# EAGLE design DC28_Jack-Attack_Badge-1 (EAGLE 9.5.0)
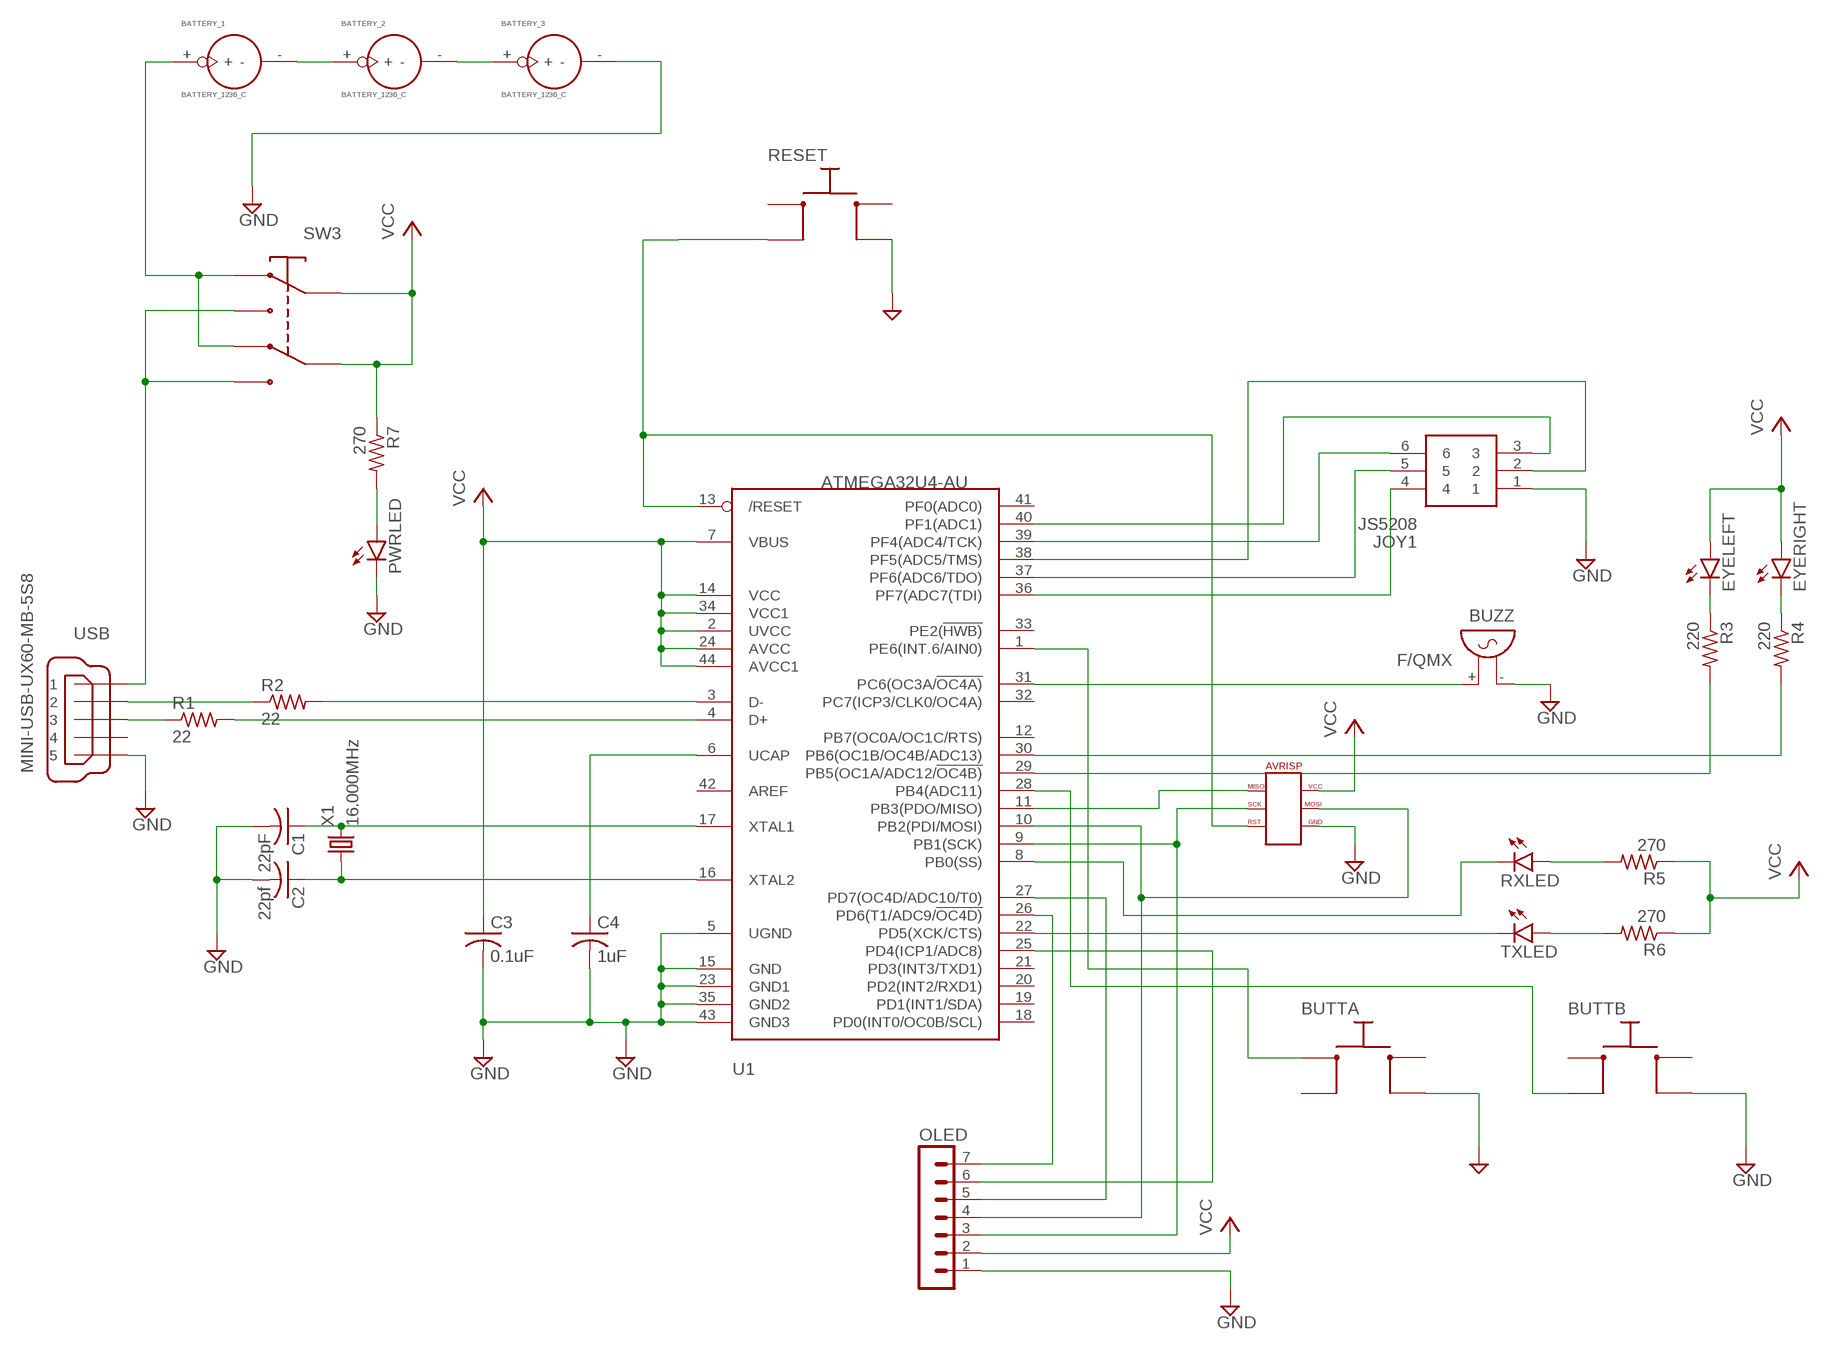
[diagram p0: schematic, sheet 1]

## Parts
BATTERY_1  BATTERY_1236_C  [BATTERY_1236_C]
BATTERY_2  BATTERY_1236_C  [BATTERY_1236_C]
BATTERY_3  BATTERY_1236_C  [BATTERY_1236_C]
BUTTA  PTS645  [PTS645_SMD]
BUTTB  PTS645  [PTS645_SMD]
BUZZ  F/QMX  [F/QMX]
C1  22pF  C-USC0805  [C0805]
C2  22pf  C-USC0805  [C0805]
C3  0.1uF  C-USC0805  [C0805]
C4  1uF  C-USC0805  [C0805]
EYELEFT  LED5MM  [LED5MM]
EYERIGHT  LED5MM  [LED5MM]
JOY1  JS5208  [JS5208]
OLED  MA07-1  [MA07-1]
PWRLED  LEDCHIP-LED0805  [CHIP-LED0805]
R1  22  R-US_R0805  [R0805]
R2  22  R-US_R0805  [R0805]
R3  220  R-US_R0805  [R0805]
R4  220  R-US_R0805  [R0805]
R5  270  R-US_R0805  [R0805]
R6  270  R-US_R0805  [R0805]
R7  270  R-US_R0805  [R0805]
RESET  PTS645  [PTS645_SMD]
RXLED  LEDCHIP-LED0805  [CHIP-LED0805]
SW3  JS202011AQN  [JS202011AQN]
TXLED  LEDCHIP-LED0805  [CHIP-LED0805]
U1  ATMEGA32U4-AU  [TQFP44]
U$1  AVRISP_POGO  [AVRISP_POGO]
USB  MINI-USB-UX60-MB-5S8  [UX60-MB-5S8]
X1  16.000MHz  CSM-7X-DU  [CSM-7X-DU]

## Nets
BATT1: BATTERY_1.+ SW3.P$1 SW3.P$4
GND: BATTERY_3.- BUTTA.P$4 BUTTB.P$4 BUZZ.- C1.2 C2.2 C3.2 C4.2 JOY1.1 OLED.1 PWRLED.C RESET.P$4 U1.5(UGND) U1.15(GND) U1.23(GND1) U1.35(GND2) U1.43(GND3) U$1.P$6 U$1.P$6B USB.5
N$1: R1.1 USB.3
N$2: R2.2 U1.3(D-)
N$3: R2.1 USB.2
N$4: R1.2 U1.4(D+)
N$5: C4.1 U1.6(UCAP)
N$6: BUTTA.P$1 U1.1(PE6(INT.6/AIN0))
N$7: C2.1 U1.16(XTAL2) X1.1
N$8: C1.1 U1.17(XTAL1) X1.2
N$9: JOY1.4 U1.36(PF7(ADC7(TDI))
N$10: U1.11(PB3(PDO/MISO)) U$1.P$1 U$1.P$1B
N$11: OLED.3 U1.9(PB1(SCK)) U$1.P$3 U$1.P$3B
N$12: OLED.4 U1.10(PB2(PDI/MOSI)) U$1.P$4 U$1.P$4B
N$13: JOY1.5 U1.37(PF6(ADC6/TDO))
N$14: BUTTB.P$2 U1.28(PB4(ADC11))
N$15: RESET.P$2 U1.13(/RESET) U$1.P$5 U$1.P$5B
N$16: BUZZ.+ U1.31(PC6(OC3A/!OC4A))
N$17: TXLED.C U1.22(PD5(XCK/CTS))
N$18: JOY1.6 U1.39(PF4(ADC4/TCK))
N$19: JOY1.2 U1.38(PF5(ADC5/TMS))
N$20: R6.2 TXLED.A
N$21: RXLED.C U1.8(PB0(SS))
N$22: R5.2 RXLED.A
N$23: JOY1.3 U1.40(PF1(ADC1))
N$24: PWRLED.A R7.2
N$25: OLED.5 U1.27(PD7(OC4D/ADC10/T0))
N$26: OLED.6 U1.25(PD4(ICP1/ADC8))
N$27: BATTERY_1.- BATTERY_2.+
N$28: BATTERY_2.- BATTERY_3.+
N$29: OLED.7 U1.26(PD6(T1/ADC9/!OC4D))
N$30: R4.2 U1.30(PB6(OC1B/OC4B/ADC13))
N$31: R3.2 U1.29(PB5(OC1A/ADC12/!OC4B))
N$34: EYERIGHT.K(C) R4.1
N$35: EYELEFT.K(C) R3.1
USB+5V: SW3.P$3 SW3.P$6 USB.1
VCC: C3.1 EYELEFT.A EYERIGHT.A OLED.2 R5.1 R6.1 R7.1 SW3.P$2 SW3.P$5 U1.2(UVCC) U1.7(VBUS) U1.14(VCC) U1.24(AVCC) U1.34(VCC1) U1.44(AVCC1) U$1.P$2 U$1.P$2B
Unconnected: BUTTA.P$2 BUTTA.P$3 BUTTB.P$1 BUTTB.P$3 RESET.P$1 RESET.P$3 U1.12(PB7(OC0A/OC1C/RTS)) U1.18(PD0(INT0/OC0B/SCL)) U1.19(PD1(INT1/SDA)) U1.20(PD2(INT2/RXD1)) U1.21(PD3(INT3/TXD1)) U1.32(PC7(ICP3/CLK0/OC4A)) U1.33(PE2(!HWB)) U1.41(PF0(ADC0)) U1.42(AREF) USB.4

## Library data of the parts
BATTERY_1-BATTERY_3 = Itead_BP_110825:BATTERY_1236_C: SOC004
BUTTA BUTTB RESET = macetech:PTS645
BUZZ = buzzer:F/QMX: BUZZER Source: Buerklin; OC_FARNELL: unknown; OC_NEWARK: unknown
C1-C4 = rcl:C-US: CAPACITOR, American symbol
EYELEFT EYERIGHT PWRLED RXLED TXLED = led:LED: LED OSRAM: - CHIPLED LG R971, LG N971, LY N971, LG Q971, LY Q971, LO R971, LY R971 LH N974, LH R974 LS Q976, LO Q976, LY Q976 LO Q996 - Hyper CHIPLED LW Q18S LB Q993, LB Q99A, LB R99A - SideLED LS A670, LO A670, LY A670, LG A670, LP A670 LB A673, LV A673, LT A673, LW A673 LH A674 LY A675 LS A676, LA A676, LO A676, LY A676, LW A676 LS A679, LY A679, LG A679 - Hyper Micro SIDELED® LS Y876, LA Y876, LO Y876, LY Y876 LT Y87S - SmartLED LW L88C, LW L88S LB L89C, LB L89S, LG L890 LS L89K, LO L89K, LY L89K LS L896, LA L896, LO L896, LY L896 - TOPLED LS T670, LO T670, LY T670, LG T670, LP T670 LSG T670, LSP T670, LSY T670, LOP T670, LYG T670 LG T671, LOG T671, LSG T671 LB T673, LV T673, LT T673, LW T673 LH T674 LS T676, LA T676, LO T676, LY T676, LB T676, LH T676, LSB T676, LW T676 LB T67C, LV T67C, LT T67C, LS T67K, LO T67K, LY T67K, LW E67C LS E67B, LA E67B, LO E67B, LY E67B, LB E67C, LV E67C, LT E67C LW T67C LS T679, LY T679, LG T679 LS T770, LO T770, LY T770, LG T770, LP T770 LB T773, LV T773, LT T773, LW T773 LH T774 LS E675, LA E675, LY E675, LS T675 LS T776, LA T776, LO T776, LY T776, LB T776 LHGB T686 LT T68C, LB T68C - Hyper Mini TOPLED® LB M676 - Mini TOPLED Santana® LG M470 LS M47K, LO M47K, LY M47K Source: http://www.osram.convergy.de LUXEON: - LUMILED® LXK2-PW12-R00, LXK2-PW12-S00, LXK2-PW14-U00, LXK2-PW14-V00 LXK2-PM12-R00, LXK2-PM12-S00, LXK2-PM14-U00 LXK2-PE12-Q00, LXK2-PE12-R00, LXK2-PE12-S00, LXK2-PE14-T00, LXK2-PE14-U00 LXK2-PB12-K00, LXK2-PB12-L00, LXK2-PB12-M00, LXK2-PB14-N00, LXK2-PB14-P00, LXK2-PB14-Q00 LXK2-PR12-L00, LXK2-PR12-M00, LXK2-PR14-Q00, LXK2-PR14-R00 LXK2-PD12-Q00, LXK2-PD12-R00, LXK2-PD12-S00 LXK2-PH12-R00, LXK2-PH12-S00 LXK2-PL12-P00, LXK2-PL12-Q00, LXK2-PL12-R00 Source: www.luxeon.com KINGBRIGHT: KA-3528ASYC Source: www.kingbright.com
JOY1 = JS5208:JS5208: E-SWITCH - JS5208 - SWITCH, NAVIGATION, 5 POSITION, 20mA, SMD Source: Datasheet <https://www.e-switch.com/system/asset/product_line/data_sheet/23/JS5208.pdf>; DESCRIPTION: E-SWITCH - JS5208 - SWITCH, NAVIGATION, 5 POSITION, 20mA, SMD; HEIGHT: mm; MANUFACTURER_NAME: E-Switch; MANUFACTURER_PART_NUMBER: JS5208; MOUSER_PART_NUMBER: 612-JS5208; MOUSER_PRICE-STOCK: https://www.mouser.com/Search/Refine.aspx?Keyword=612-JS5208
OLED = con-lstb:MA07-1: PIN HEADER; OC_FARNELL: unknown; OC_NEWARK: unknown
R1-R7 = rcl:R-US_: RESISTOR, American symbol
SW3 = macetech:JS202011AQN
U1 = adafruit:ATMEGA32U4: http://www.ladyada.net/library/eagle
U$1 = macetech:AVRISP_POGO
USB = con-hirose:MINI-USB-: MINI USB Connector Source: http://www.hirose.co.jp/cataloge_hp/e24000019.pdf; OC_FARNELL: unknown; OC_NEWARK: unknown
X1 = crystal:CSM-7X-DU: SMD CRYSTAL Source: www.ecsxtal.com .. Crystal 3.6864MHz CSM_7X_DU.PDF; OC_FARNELL: unknown; OC_NEWARK: unknown

## Board
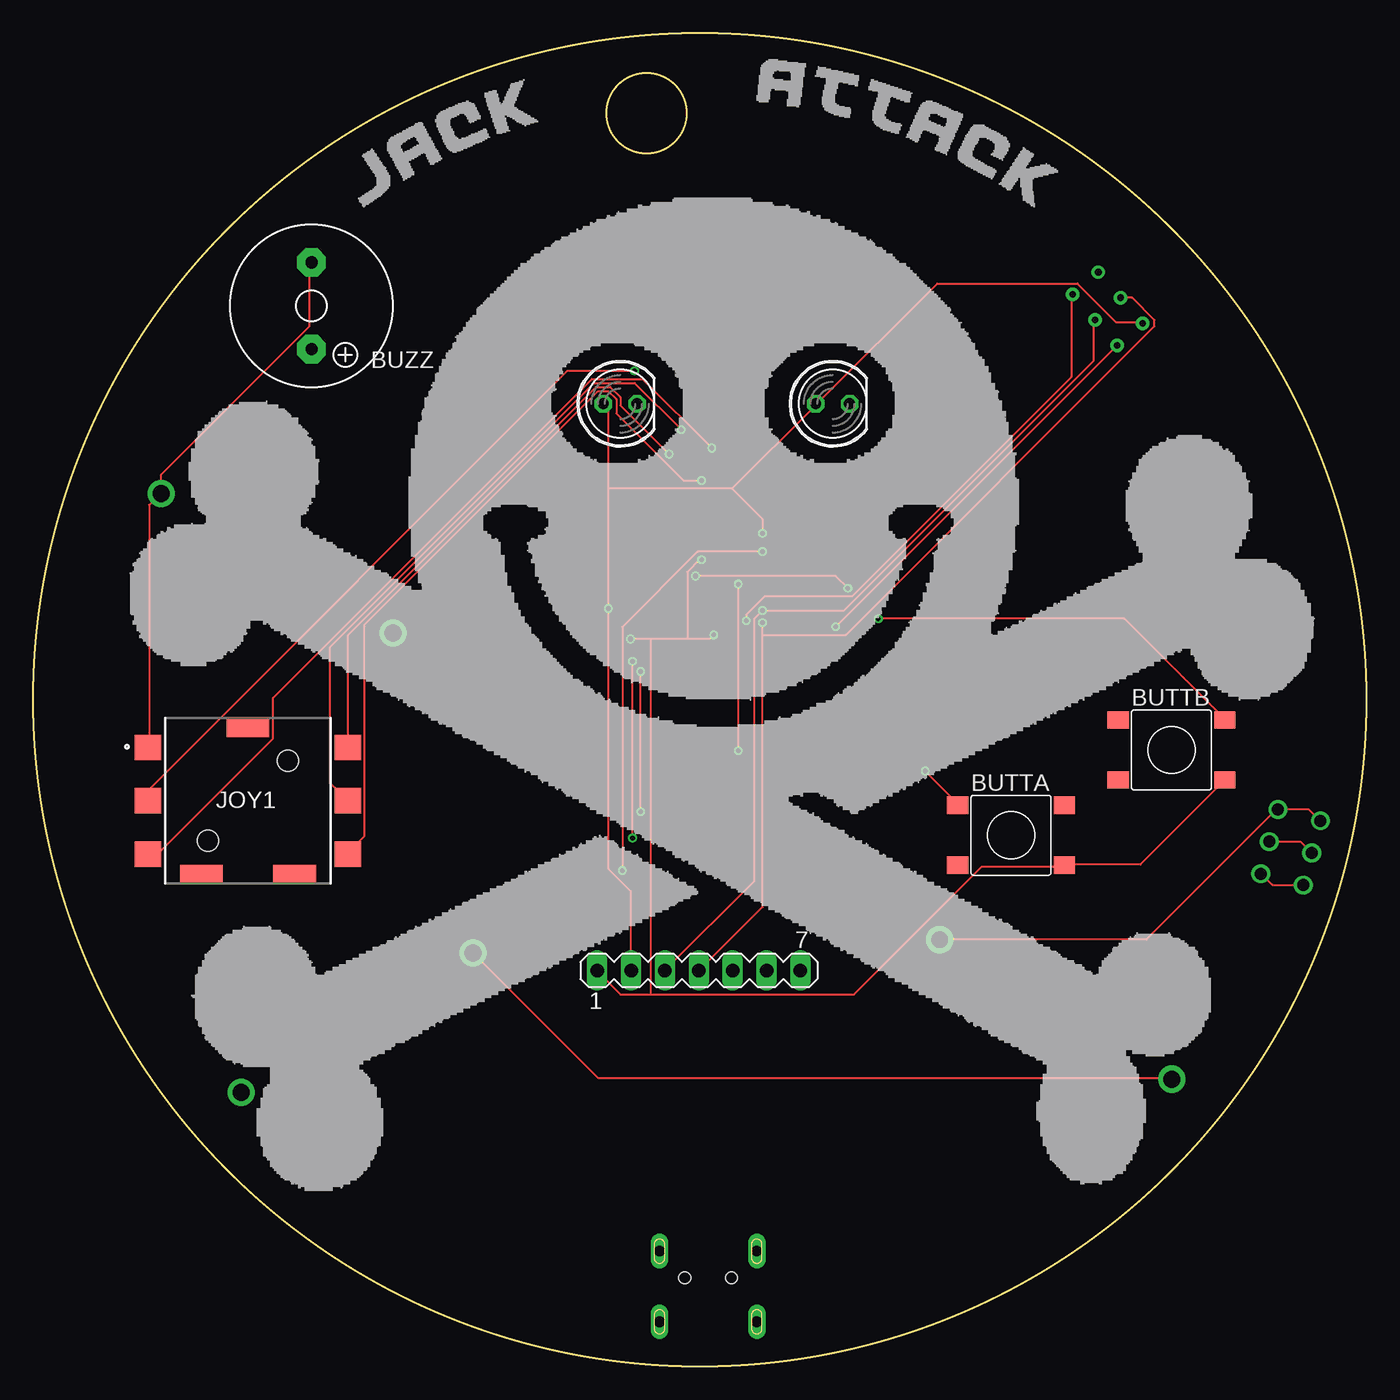
[diagram p1: board, top side]
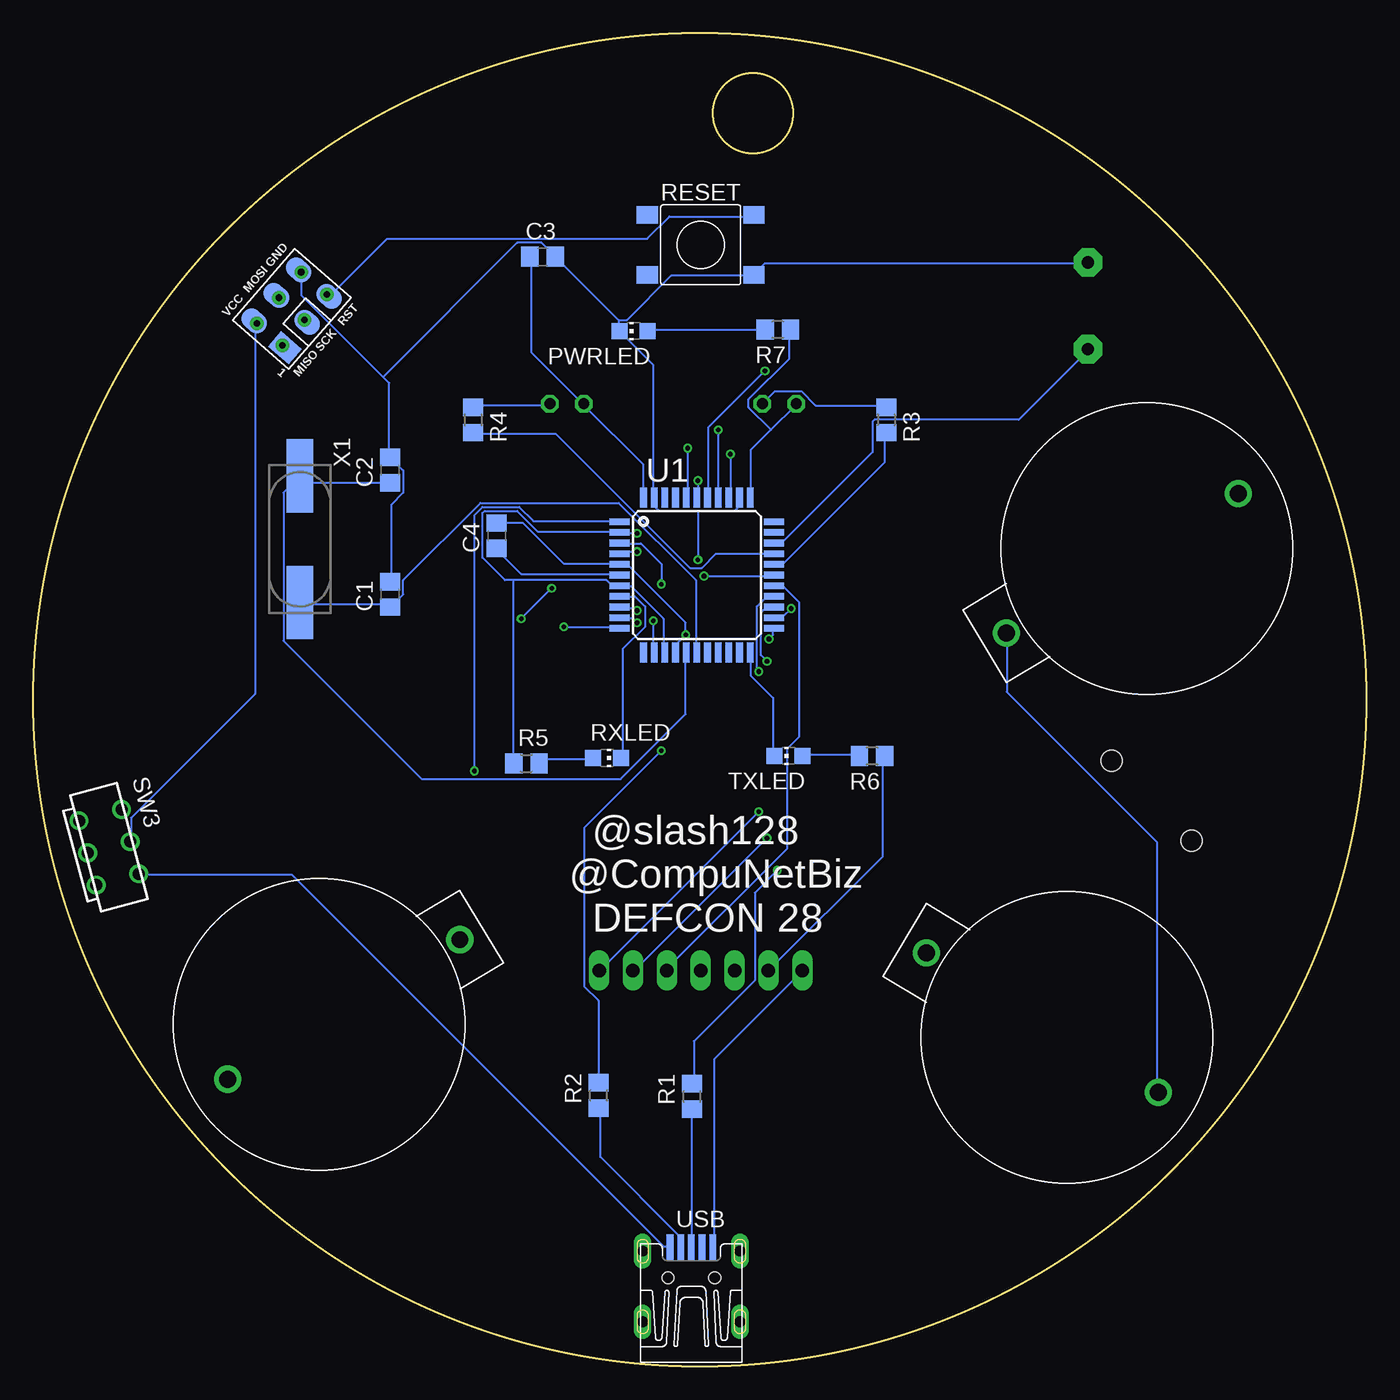
[diagram p2: board, bottom side, seen from below]

Size 100 x 100 mm. Coordinates in mm from the lower left corner, seen from the top.
Outline: circle at 50,50 radius 50
Outline: circle at 46,94 radius 3
Copper layers (1*16): Top 0.035mm / dielectric 1.5mm / Bottom 0.035mm
Design rules "SeeedStudio_2layer_DRU_no_angle_20140221": minimum track width 6mil, minimum drill 12mil, track to track 6mil, track to pad 6mil, pad to pad 6mil, via to via 6mil, smd to smd 0mil, copper to edge 10mil, drill to drill 10mil, minimum pad ring 10mil, minimum via ring 6mil, stop-mask expansion 2mil, vias tented up to drill 100mil, thermal gap 10mil

### Footprints (pad centres in the part's own frame; a part is rotated, then mirrored left to right if it is on the bottom)
BATTERY_1236_C = drill 1.27 pad 2.032: + 0,0; - 0,20.32
PTS645_SMD = smd 1.6 x 1.3: P$1 -4,2.25; P$2 4,2.25; P$3 -4,-2.25; P$4 4,-2.25
F/QMX = drill 0.914 pad 2.159 octagon: + 3.251,0; - -3.251,0
C0805 = smd 1.3 x 1.5: 1 -0.95,0; 2 0.95,0
LED5MM = drill 0.813 octagon: A -1.27,0; K 1.27,0
JS5208 = smd 2 x 1.9: 1 -7.5,4; 2 -7.5,0; 3 -7.5,-4; 4 7.5,4; 5 7.5,0; 6 7.5,-4 | smd 3.2 x 1.45: 7 -3.5,-5.525; 8 3.5,-5.525; 9 0,5.525 | hole 1.6: 3,3; -3,-3
MA07-1 = drill 1.016 long: 1 -7.62,0; 2 -5.08,0; 3 -2.54,0; 4 0,0; 5 2.54,0; 6 5.08,0; 7 7.62,0
CHIP-LED0805 = smd 1.2 x 1.2: A 0,-1.05; C 0,1.05
R0805 = smd 1.3 x 1.5: 1 -0.95,0; 2 0.95,0
JS202011AQN = drill 0.9: P$1 -2.5,1.65; P$2 0,1.65; P$3 2.5,1.65; P$4 -2.5,-1.65; P$5 0,-1.65; P$6 2.5,-1.65
TQFP44 = smd 1.5 x 0.5: 1 -5.8,4; 2 -5.8,3.2; 3 -5.8,2.4; 4 -5.8,1.6; 5 -5.8,0.8; 6 -5.8,0; 7 -5.8,-0.8; 8 -5.8,-1.6; 9 -5.8,-2.4; 10 -5.8,-3.2; 11 -5.8,-4; 23 5.8,-4; 24 5.8,-3.2; 25 5.8,-2.4; 26 5.8,-1.6; 27 5.8,-0.8; 28 5.8,0; 29 5.8,0.8; 30 5.8,1.6; 31 5.8,2.4; 32 5.8,3.2; 33 5.8,4 | smd 0.5 x 1.5: 12 -4,-5.8; 13 -3.2,-5.8; 14 -2.4,-5.8; 15 -1.6,-5.8; 16 -0.8,-5.8; 17 0,-5.8; 18 0.8,-5.8; 19 1.6,-5.8; 20 2.4,-5.8; 21 3.2,-5.8; 22 4,-5.8; 34 4,5.8; 35 3.2,5.8; 36 2.4,5.8; 37 1.6,5.8; 38 0.8,5.8; 39 0,5.8; 40 -0.8,5.8; 41 -1.6,5.8; 42 -2.4,5.8; 43 -3.2,5.8; 44 -4,5.8
AVRISP_POGO = smd 2.032 x 1.524: P$1 -1.524,2.54; P$2 1.524,2.54; P$3 -1.524,0; P$4 1.524,0; P$5 -1.524,-2.54; P$6 1.524,-2.54 | drill 0.5: P$1B -1.27,2.54; P$2B 1.27,2.54; P$3B -1.27,0; P$4B 1.27,0; P$5B -1.27,-2.54; P$6B 1.27,-2.54
UX60-MB-5S8 = smd 2 x 0.5: 1 8.65,1.6; 2 8.65,0.8; 3 8.65,0; 4 8.65,-0.8; 5 8.65,-1.6 | drill 0.8 long: M1 3.1,-3.65; M2 3.1,3.65; M3 8.4,3.65; M4 8.4,-3.65 | hole 0.9: 6.4,-1.75; 6.4,1.75
CSM-7X-DU = smd 5.5 x 2: 1 -4.75,0; 2 4.75,0

### Placement (x,y rotation side)
BATTERY_1  68,32 121 bottom
BATTERY_2  33,31 239 bottom
BATTERY_3  27,55 301 bottom
BUTTA  73.35,39.83 0 top
BUTTB  85.39,46.23 0 top
BUZZ  20.87,79.56 270 top
C1  73.23,57.91 90 bottom
C2  73.23,67.23 90 bottom
C3  61.79,83.23 0 bottom
C4  65.23,62.31 90 bottom
EYELEFT  44.03,72.21 0 top
EYERIGHT  59.97,72.21 0 top
JOY1  16.11,42.42 0 top
OLED  49.93,29.69 0 top
PWRLED  54.96,77.67 90 bottom
R1  50.58,20.24 90 bottom
R2  57.58,20.32 90 bottom
R3  36,71 270 bottom
R4  67,71 270 bottom
R5  63.01,45.23 0 bottom
R6  37.07,45.77 180 bottom
R7  44.15,77.77 180 bottom
RESET  49.93,84.13 0 bottom
RXLED  56.95,45.63 270 bottom
SW3  94.33,38.93 285 bottom
TXLED  43.35,45.8 90 bottom
U1  50.22,59.36 0 bottom
U$1  80.61,79.33 139 bottom
USB  50.63,0.23 90 bottom
X1  80,62.04 270 bottom

### Tracks (layer width: path | path; a pad name or v marks a point on that pad's centre or on a via)
BATT1
  Top 0.152: SW3.P$4 96.47,41 95.71,41.76 93.42,41.76 SW3.P$1 93.27,41.76 83.52,32 68.12,32 BATTERY_1.+
GND  (via drill 0.35)
  Top 0.152: 49.07,54.56 50.75,54.56 v51.05,54.86 | 49.07,54.56 46.33,54.56 | 46.33,54.56 v44.81,54.56 | BUTTB.P$4 89.31,43.89 83.06,37.64 77.42,37.64 BUTTA.P$4 77.27,37.49 71.17,37.49 61.57,27.89 46.33,27.89 | 46.33,27.89 44.04,27.89 42.37,29.57 OLED.1 | 46.33,27.89 46.33,54.56 | JOY1.1 8.69,46.48 8.69,64.62 9.45,65.38 BATTERY_3.- 9.6,65.53 9.6,66.9 20.73,78.03 20.73,82.75 BUZZ.- | 49.07,54.56 49.07,59.59 49.99,60.5 v50.14,60.5
  Bottom 0.152: v44.81,54.56 44.5,54.86 44.5,55.32 U1.23 | U1.15 51.82,53.65 51.82,54.1 v51.05,54.86 51.05,55.78 55.32,60.05 55.93,60.05 U1.5 56.08,60.2 60.2,60.2 63.25,63.25 65.23,63.25 C4.2 | USB.5 48.92,8.99 48.92,23.01 42.37,29.57 OLED.1 | U$1.P$6 80.01,82.14 U$1.P$6B 79.86,81.99 79.86,80.31 73.76,74.22 | C1.2 73.15,58.98 73.15,64.62 72.24,65.53 72.24,67.21 73.15,68.12 C2.2 73.3,68.28 73.3,73.76 73.76,74.22 | 50.14,64.16 53.03,64.16 53.34,64.47 53.34,65.08 U1.43 53.49,65.23 53.49,75.13 55.93,77.57 PWRLED.C 56.08,77.72 56.08,78.49 | 50.14,64.16 47.4,64.16 47.09,64.47 47.09,65.08 U1.35 | 56.08,78.49 60.81,83.21 C3.2 60.96,83.36 61.87,84.28 63.7,84.28 73.76,74.22 | 56.08,78.49 55.47,78.49 52.12,81.84 46.02,81.84 RESET.P$4 45.87,81.99 45.11,82.75 20.88,82.75 BUZZ.- | 50.14,64.16 v50.14,60.5
N$1
  Bottom 0.152: R1.1 50.6,19.2 50.6,8.99 USB.3
N$2  (via drill 0.35)
  Top 0.152: v52.88,58.67 v52.88,46.18
  Bottom 0.152: v52.88,46.18 58.67,40.39 58.67,28.5 57.61,27.43 57.61,21.34 R2.2 | v52.88,58.67 52.88,60.2 54.41,61.72 55.93,61.72 U1.3
N$3
  Bottom 0.152: R2.1 57.45,19.36 57.45,15.7 51.51,9.75 51.51,8.99 USB.2
N$4  (via drill 0.35)
  Top 0.152: v44.2,37.19 44.2,55.47 49.84,61.11 v54.71,61.11
  Bottom 0.152: v44.2,37.19 45.87,35.51 45.87,28.96 50.44,24.38 50.44,21.34 R1.2 | v54.71,61.11 55.78,61.11 55.93,60.96 U1.4
N$5
  Bottom 0.152: U1.6 56.08,59.44 63.4,59.44 65.23,61.27 C4.1
N$6  (via drill 0.35)
  Top 0.152: v66.9,44.65 69.34,42.22 BUTTA.P$1
  Bottom 0.152: v66.9,44.65 66.9,63.86 66.29,64.47 63.55,64.47 62.48,63.4 56.08,63.4 U1.1
N$7
  Bottom 0.152: U1.16 51.05,53.49 51.05,48.92 55.93,44.04 70.87,44.04 81.23,54.41 81.23,65.53 80.01,66.75 X1.1 79.86,66.75 79.4,66.29 73.3,66.29 C2.1
N$8
  Bottom 0.152: U1.17 50.29,53.65 50.29,58.98 56.08,64.77 66.45,64.77 72.24,58.98 72.24,57.91 73.15,57 C1.1 73.3,57 73.46,57.15 79.86,57.15 X1.2
N$9  (via drill 0.35)
  Top 0.152: v47.7,68.43 44.04,72.08 44.04,72.69 43.28,73.46 42.22,73.46 23.62,54.86 23.62,46.48 JOY1.4
  Bottom 0.152: v47.7,68.43 47.7,65.23 U1.36
N$10  (via drill 0.35)
  Top 0.152: v60.2,55.47 81.23,76.5 U$1.P$1B
  Bottom 0.152: v60.2,55.47 56.08,55.47 U1.11 | U$1.P$1 81.23,76.5 U$1.P$1B
N$11  (via drill 0.35)
  Top 0.152: OLED.3 47.4,29.72 54.1,36.42 54.1,56.08 v54.71,56.69 60.81,56.69 79.55,75.44 79.55,78.49 U$1.P$3B
  Bottom 0.152: U$1.P$3B 79.55,78.49 79.55,78.33 U$1.P$3 | v54.71,56.69 54.86,56.84 55.93,56.84 U1.9
N$12  (via drill 0.35)
  Top 0.152: 54.71,54.86 54.71,34.44 49.99,29.72 OLED.4 | 54.71,54.86 v54.71,55.78 | 54.71,54.86 60.96,54.86 84.12,78.03 84.12,78.49 82.45,80.16 81.69,80.16 U$1.P$4B
  Bottom 0.152: U$1.P$4B 81.69,80.31 U$1.P$4 | v54.71,55.78 55.02,56.08 55.93,56.08 U1.10
N$13  (via drill 0.35)
  Top 0.152: v48.62,70.26 45.11,73.76 42.06,73.76 22.25,53.95 22.25,43.74 23.47,42.52 JOY1.5
  Bottom 0.152: v48.62,70.26 48.62,65.23 U1.37
N$14  (via drill 0.35)
  Top 0.152: v49.68,59.28 60.2,59.28 v61.11,58.37 | v63.4,56.08 81.84,56.08 89.31,48.62 BUTTB.P$2
  Bottom 0.152: v49.68,59.28 44.5,59.28 U1.28 | v63.4,56.08 v61.11,58.37
N$15  (via drill 0.35)
  Top 0.152: v53.49,55.93 53.49,56.39 54.86,57.76 61.42,57.76 77.88,74.22 77.88,80.31 U$1.P$5B
  Bottom 0.152: v53.49,55.93 53.49,53.65 U1.13 | RESET.P$2 46.02,86.26 52.27,86.26 53.95,84.58 73.46,84.58 77.72,80.31 U$1.P$5B 77.88,80.31 U$1.P$5
N$16
  Bottom 0.152: U1.31 44.35,61.87 43.74,61.87 37.03,68.58 37.03,70.87 36.88,71.02 26.06,71.02 20.88,76.2 BUZZ.+
N$17
  Bottom 0.152: TXLED.C 44.5,45.87 44.5,50.14 46.18,51.82 46.18,53.49 U1.22
N$18  (via drill 0.35)
  Top 0.152: v50.14,66.45 48.77,66.45 43.74,71.48 43.74,72.54 43.13,73.15 42.37,73.15 24.84,55.63 24.84,39.78 23.62,38.56 JOY1.6
  Bottom 0.152: v50.14,66.45 50.14,65.23 U1.39
N$19  (via drill 0.35)
  Top 0.152: v45.11,74.68 40.08,74.68 8.69,43.28 8.69,42.52 JOY1.2
  Bottom 0.152: v45.11,74.68 49.38,70.41 49.38,65.23 U1.38
N$20
  Bottom 0.152: TXLED.A 42.22,45.87 38.1,45.87 R6.2
N$21
  Bottom 0.152: RXLED.C 55.78,45.72 55.78,53.8 54.1,55.47 54.1,57 54.86,57.76 55.93,57.76 U1.8
N$22
  Bottom 0.152: RXLED.A 58.06,45.57 61.72,45.57 62.03,45.26 R5.2
N$23  (via drill 0.35)
  Top 0.152: v50.9,68.89 45.72,74.07 41.91,74.07 17.98,50.14 17.98,47.09 9.45,38.56 8.69,38.56 JOY1.3
  Bottom 0.152: v50.9,68.89 50.9,65.23 U1.40
N$24
  Bottom 0.152: PWRLED.A 53.8,77.72 45.11,77.72 R7.2
N$25
  Bottom 0.152: U1.27 44.35,58.52 43.74,58.52 42.52,57.3 42.52,47.24 43.43,46.33 43.43,38.86 52.58,29.72 OLED.5
N$26  (via drill 0.35)
  Top 0.152: v44.96,39.62 v44.96,52.88
  Bottom 0.152: v44.96,52.88 45.41,53.34 45.41,56.54 45.11,56.84 44.5,56.84 U1.25 | v44.96,39.62 54.86,29.72 OLED.6
N$27
  Top 0.152: BATTERY_1.- 85.34,21.64 42.37,21.64 33.07,30.94 BATTERY_2.+
N$28
  Bottom 0.152: BATTERY_2.- 15.7,20.57 15.7,39.32 26.98,50.6 26.98,54.86 BATTERY_3.+
N$29  (via drill 0.35)
  Top 0.152: v45.57,41.6 v45.57,52.12
  Bottom 0.152: v45.57,52.12 45.72,52.27 45.72,57 44.96,57.76 44.5,57.76 U1.26 | v45.57,41.6 57.45,29.72 OLED.7
N$30
  Bottom 0.152: U1.30 48.77,60.96 49.84,59.89 50.75,59.89 60.81,69.95 66.9,69.95 R4.2
N$31
  Bottom 0.152: R3.2 36.12,69.95 36.12,67.82 43.74,60.2 44.35,60.2 U1.29
N$34
  Bottom 0.152: R4.1 66.9,72.08 61.27,72.08 EYERIGHT.K
N$35
  Bottom 0.152: R3.1 36.12,72.08 41.3,72.08 42.37,73.15 44.35,73.15 45.26,72.24 EYELEFT.K
USB+5V
  Top 0.152: SW3.P$6 95.25,36.12 92.96,36.12 92.2,36.88 SW3.P$3
  Bottom 0.152: USB.1 52.27,8.99 52.73,8.99 80.62,36.88 92.05,36.88 SW3.P$3
VCC  (via drill 0.35)
  Top 0.152: 43.13,65.84 43.13,71.78 42.82,72.08 EYELEFT.A | 43.13,65.84 v43.13,56.84 43.13,37.34 44.81,35.66 44.81,29.72 OLED.2 | SW3.P$2 92.81,39.32 95.1,39.32 95.86,38.56 SW3.P$5 | U$1.P$2B 83.21,78.33 81.23,78.33 78.33,81.23 67.82,81.23 58.83,72.24 EYERIGHT.A 58.67,72.08 52.43,65.84 | 52.43,65.84 43.13,65.84 | v54.71,62.48 54.71,63.55 52.43,65.84
  Bottom 0.152: U1.14 52.73,53.65 52.73,56.08 55.17,58.52 55.93,58.52 U1.7 56.08,58.67 56.69,58.67 57,58.98 64.01,58.98 | 64.01,58.98 64.62,58.98 66.29,60.66 66.29,64.01 66.14,64.16 63.7,64.16 62.18,62.64 56.08,62.64 U1.2 55.93,62.48 v54.71,62.48 | 64.01,58.98 64.01,45.26 R5.1 | R6.1 36.27,45.72 36.27,38.25 44.81,29.72 OLED.2 | v43.13,56.84 43.74,56.24 44.35,56.24 U1.24 | 44.65,70.26 42.82,72.08 EYELEFT.A | 44.65,70.26 46.18,68.73 46.18,65.23 U1.34 | 44.65,70.26 46.33,71.93 46.33,72.54 43.28,75.59 43.28,77.72 R7.1 | U$1.P$2 83.36,78.33 U$1.P$2B 83.36,78.18 83.36,50.44 92.66,41.15 92.66,39.47 SW3.P$2 | U1.44 54.25,65.23 54.25,67.67 58.67,72.08 EYERIGHT.A 58.83,72.24 62.64,76.05 62.64,83.21 C3.1

### Text on the board
bPlace: @slash128 / @CompuNetBiz / DEFCON 28
210bmp: @slash128 | @Compunetbiz | DefCon 28